# EAGLE design top board (EAGLE 7.6.0)
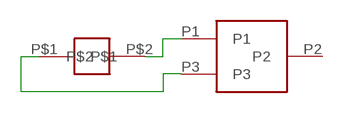
[diagram p0: schematic, sheet 1]

## Parts
U$1  AVX_CONN  [AVX_CONN]
U$2  RING  [RING]

## Nets
N$3: U$1.P1 U$2.P$2
N$4: U$1.P3 U$2.P$1
Unconnected: U$1.P2

## Library data of the parts
U$1 = CUSTOM:AVX_CONN
U$2 = CUSTOM:RING

## Board
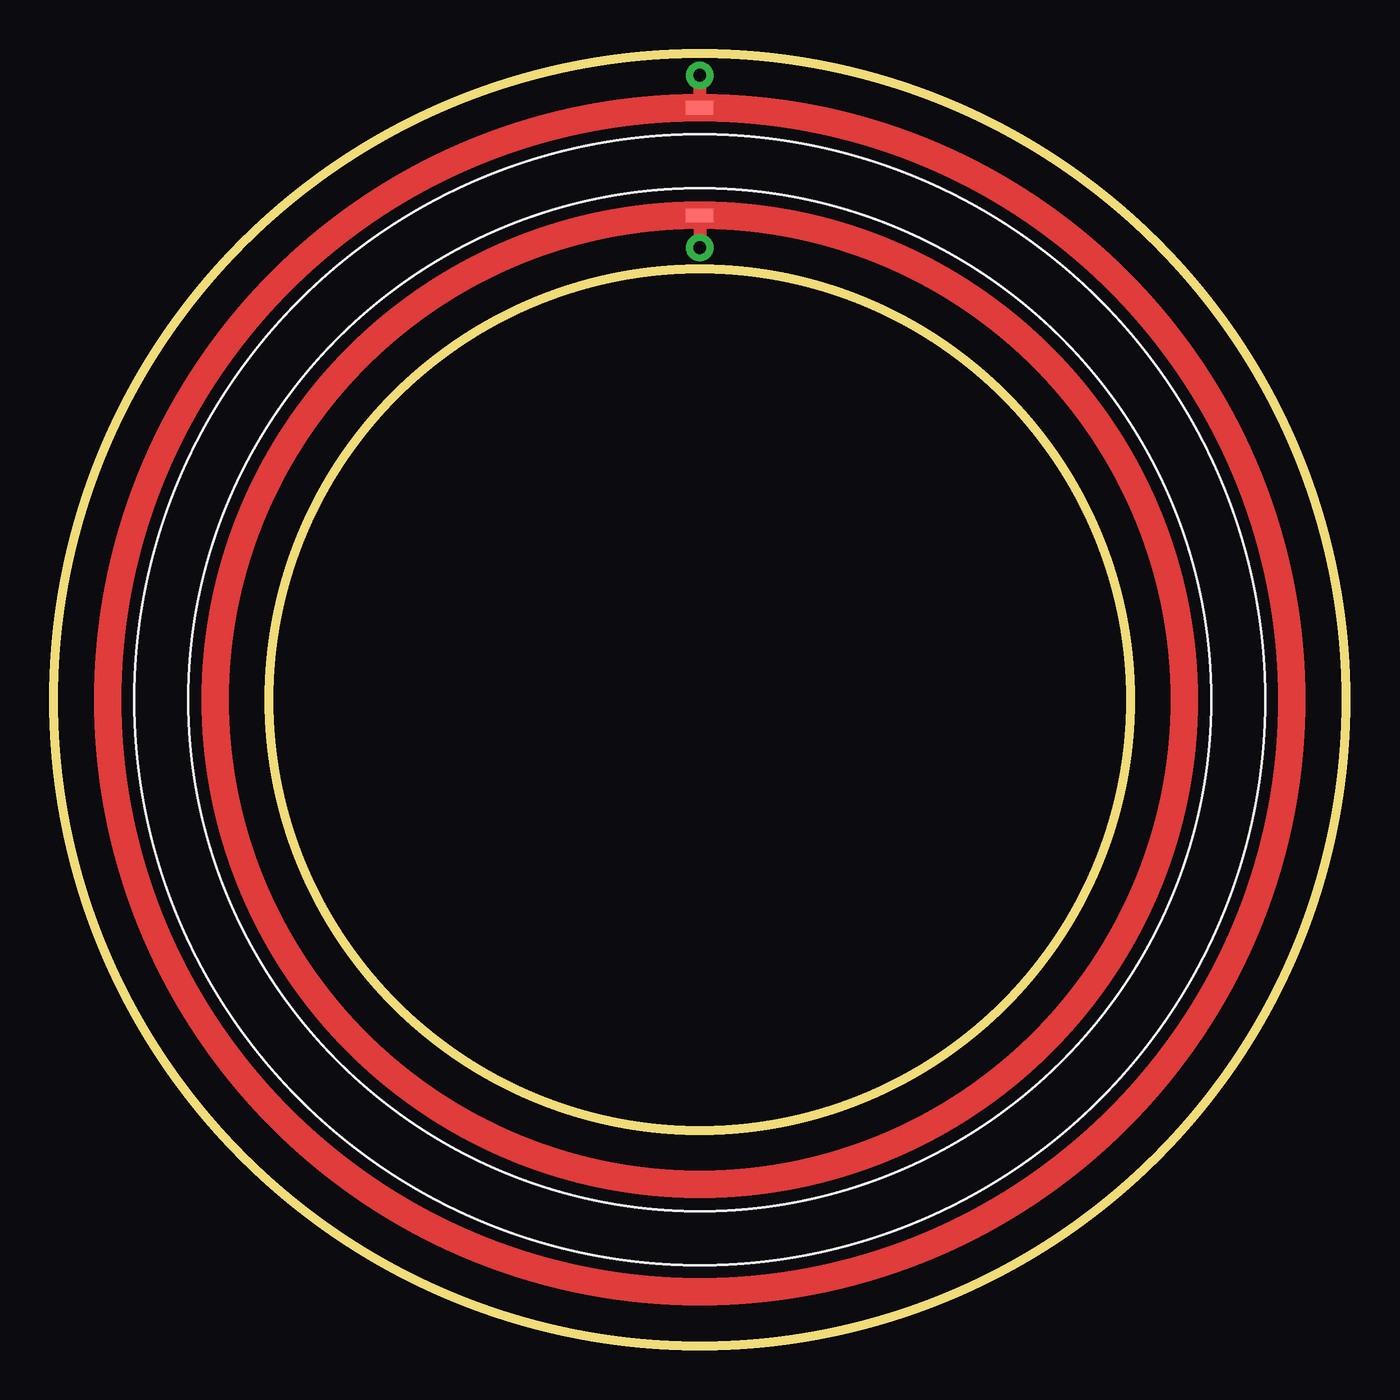
[diagram p1: board, top side]
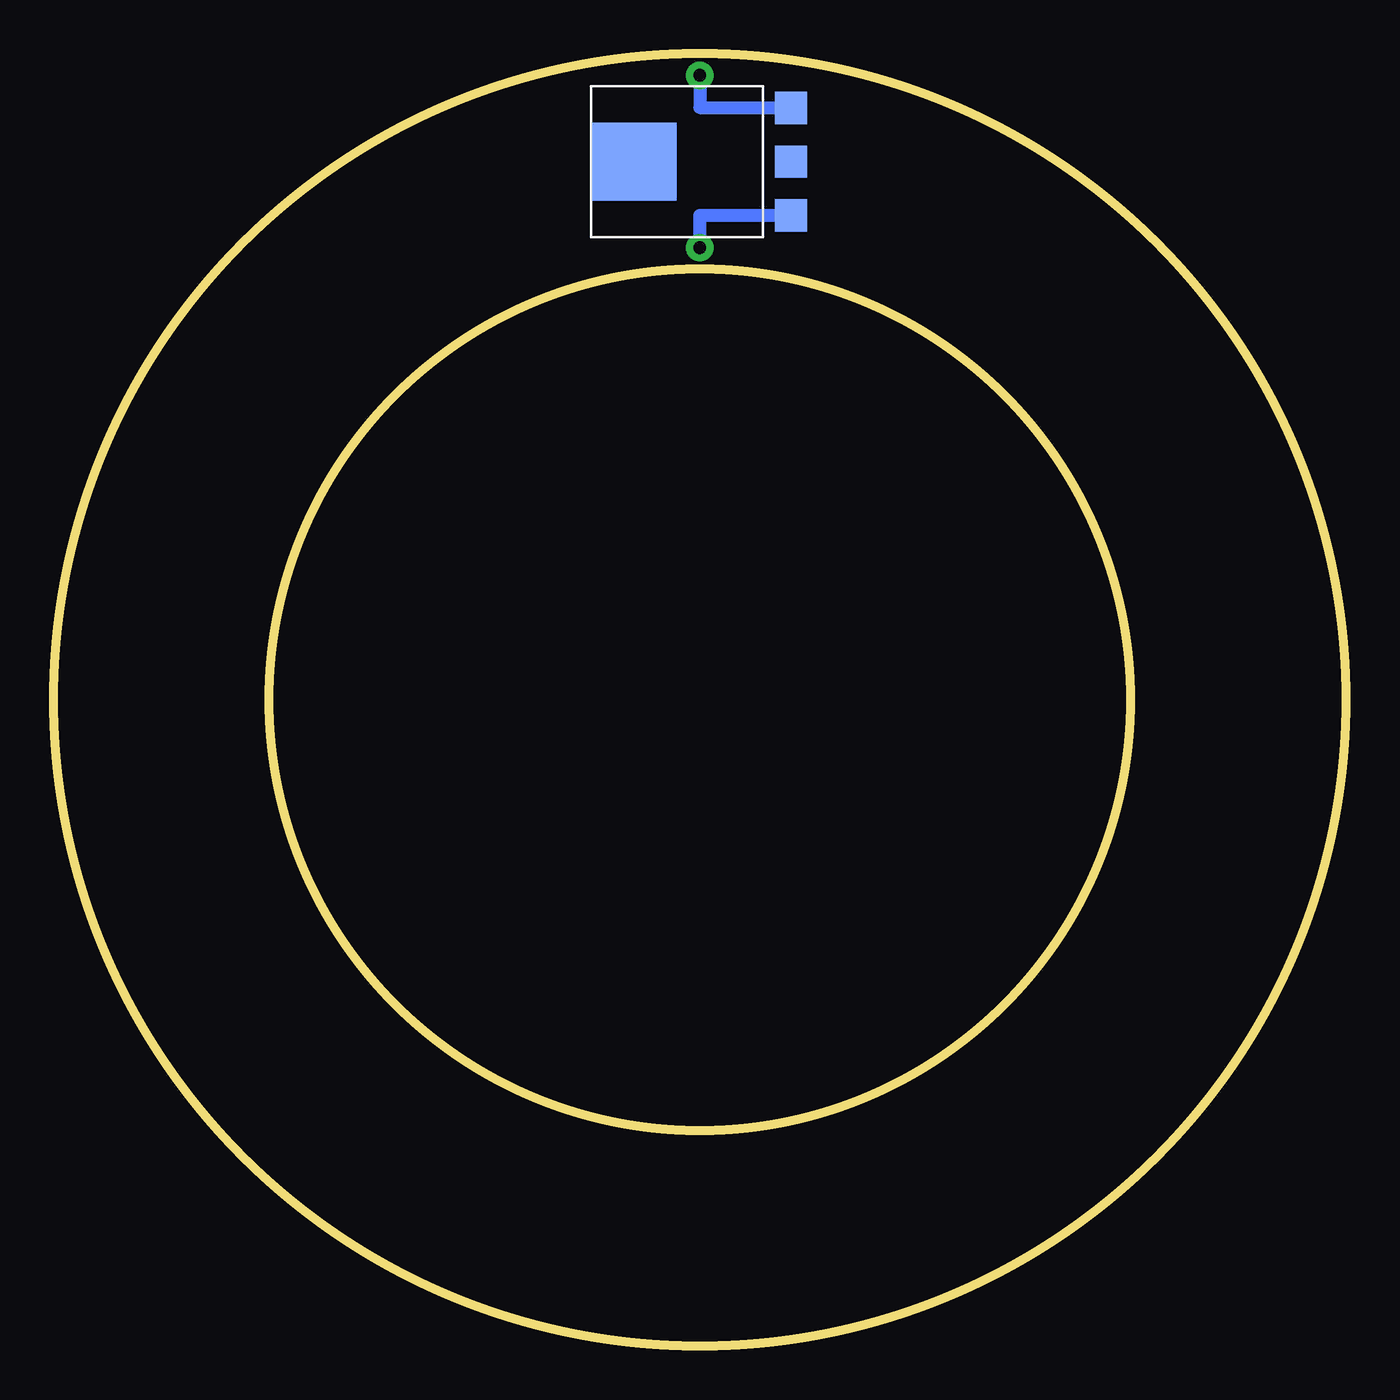
[diagram p2: board, bottom side, seen from below]

Size 60 x 60 mm. Coordinates in mm from the lower left corner, seen from the top.
Outline: circle at 30,30 radius 30
Outline: circle at 30,30 radius 20
Copper layers (1*16): Top 0.035mm / dielectric 1.5mm / Bottom 0.035mm
Design rules "default": minimum track width 10mil, minimum drill 24mil, track to track 8mil, track to pad 8mil, pad to pad 8mil, via to via 8mil, smd to smd 8mil, copper to edge 40mil, drill to drill 8mil, minimum pad ring 10mil, minimum via ring 8mil, stop-mask expansion 4mil, vias tented up to drill 0mil, thermal gap 10mil

### Footprints (pad centres in the part's own frame; a part is rotated, then mirrored left to right if it is on the bottom)
AVX_CONN = smd 1.5 x 1.5 bottom: P1 -2.5,-4.3; P2 0,-4.3; P3 2.5,-4.3 | smd 3.6 x 3.95 bottom: P$2 0,3
RING = smd 1.27 x 0.635: P$1 0,22.5; P$2 0,27.5

### Placement (x,y rotation side)
U$1  30.06,54.99 270 top
U$2  30,30 0 top

### Tracks (layer width: path | path; a pad name or v marks a point on that pad's centre or on a via)
N$3  (via drill 0.6 pad 1.27)
  Top 0.61: U$2.P$2 v30,59
  Bottom 0.61: v30,59 U$2.P$2 U$1.P1
N$4  (via drill 0.6 pad 1.27)
  Top 0.61: U$2.P$1 v30,51
  Bottom 0.61: v30,51 U$2.P$1 U$1.P3